# Altium schematic sheet Cas_1.SchDoc
size A4; SheetNumber: 1; SheetTotal: 1
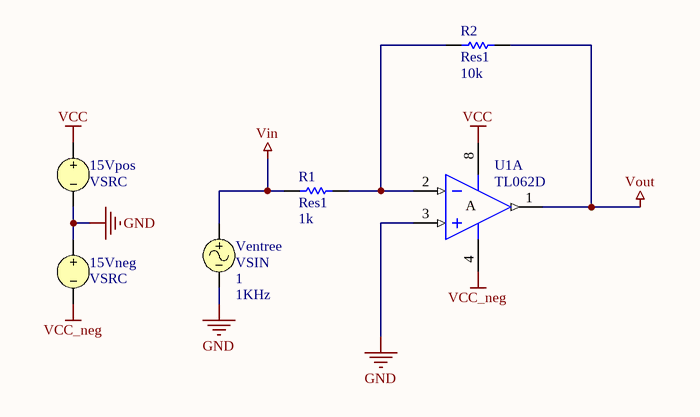
[diagram p0: Cas_1.SchDoc]

## Parts
15Vneg  VSRC
15Vpos  VSRC
R1  Res1  value 1k  [AXIAL-0.3]
R2  Res1  value 10k  [AXIAL-0.3]
U1  TL062D  [D008_L]  (part A of 2)
Ventree  VSIN  Amplitude: 1  Frequency: 1KHz

## Nets
GND: 15Vneg.1 15Vpos.2 U1.3(IN+) Ventree.2
VCC: 15Vpos.1 U1.8(V+)
VCC_neg: 15Vneg.2 U1.4(V-)
Vin: R1.1 Ventree.1
Vout: R2.2 U1.1(OUT)
NetR1_2: R1.2 R2.1 U1.2(IN-)

## Notes on the sheet
- (in symbol TL062D, part A) A

## Library data of the parts
15Vneg 15Vpos = VSRC: Voltage Source; Note: PCB Footprint - Not required; AC Magnitude: 1; AC Phase: 0; Value: 15; Published: 30-July-2020; LatestRevisionDate: 30-July-2020; LatestRevisionNote: Re-released for DXP Platform.; PackageReference: Not Applicable; Publisher: Altium Limited
R1 R2 = Res1: Resistor; Published: 8-Jun-2000; LatestRevisionDate: 17-Jul-2002; LatestRevisionNote: Re-released for DXP Platform.; PackageReference: AXIAL-0.3; Publisher: Altium Limited; PackageDescription: Axial Device, Thru-Hole; 2 Leads; 0.3 in Pin Spacing
U1 = TL062D: Low-Power JFET-Input Operational Amplifier; Published: 16-Jan-2001; LatestRevisionDate: 13-Apr-2006; LatestRevisionNote: IPC-7351 Footprint Added.; DatasheetVersion: Jan-1999; PackageVersion: Jan-1998; PackageReference: D008; Publisher: Altium Limited; PackageDescription: 8-Pin Small Outline Integrated Circuit 1.27 mm Pitch; Code_IPC: SOIC127P600-8; ComponentLink1Description: Manufacturer Link; ComponentLink1URL: http://www.ti.com/; ComponentLink2Description: Datasheet; ComponentLink2URL: http://www-s.ti.com/sc/ds/tl062.pdf
Ventree = VSIN: Sinusoidal Voltage Source; Note: PCB Footprint - Not required; Offset: 0; Published: 8-Jun-2000; LatestRevisionDate: 15-Nov-2004; LatestRevisionNote: Corrected Netlist.; PackageReference: Not Applicable; Publisher: Altium Limited; Delay: 0; Damping Factor: 0; Phase: 0; DC Magnitude: 0; AC Magnitude: 1; AC Phase: 0